# Altium schematic sheet S7CAS-PLEIADES-CARTE-MERE_P01_MOTORS.SchDoc
size Tabloid; DocumentNumber: 9; SheetNumber: 9; SheetTotal: 17; Sheet_Name: MOTORS; Size: 11x17
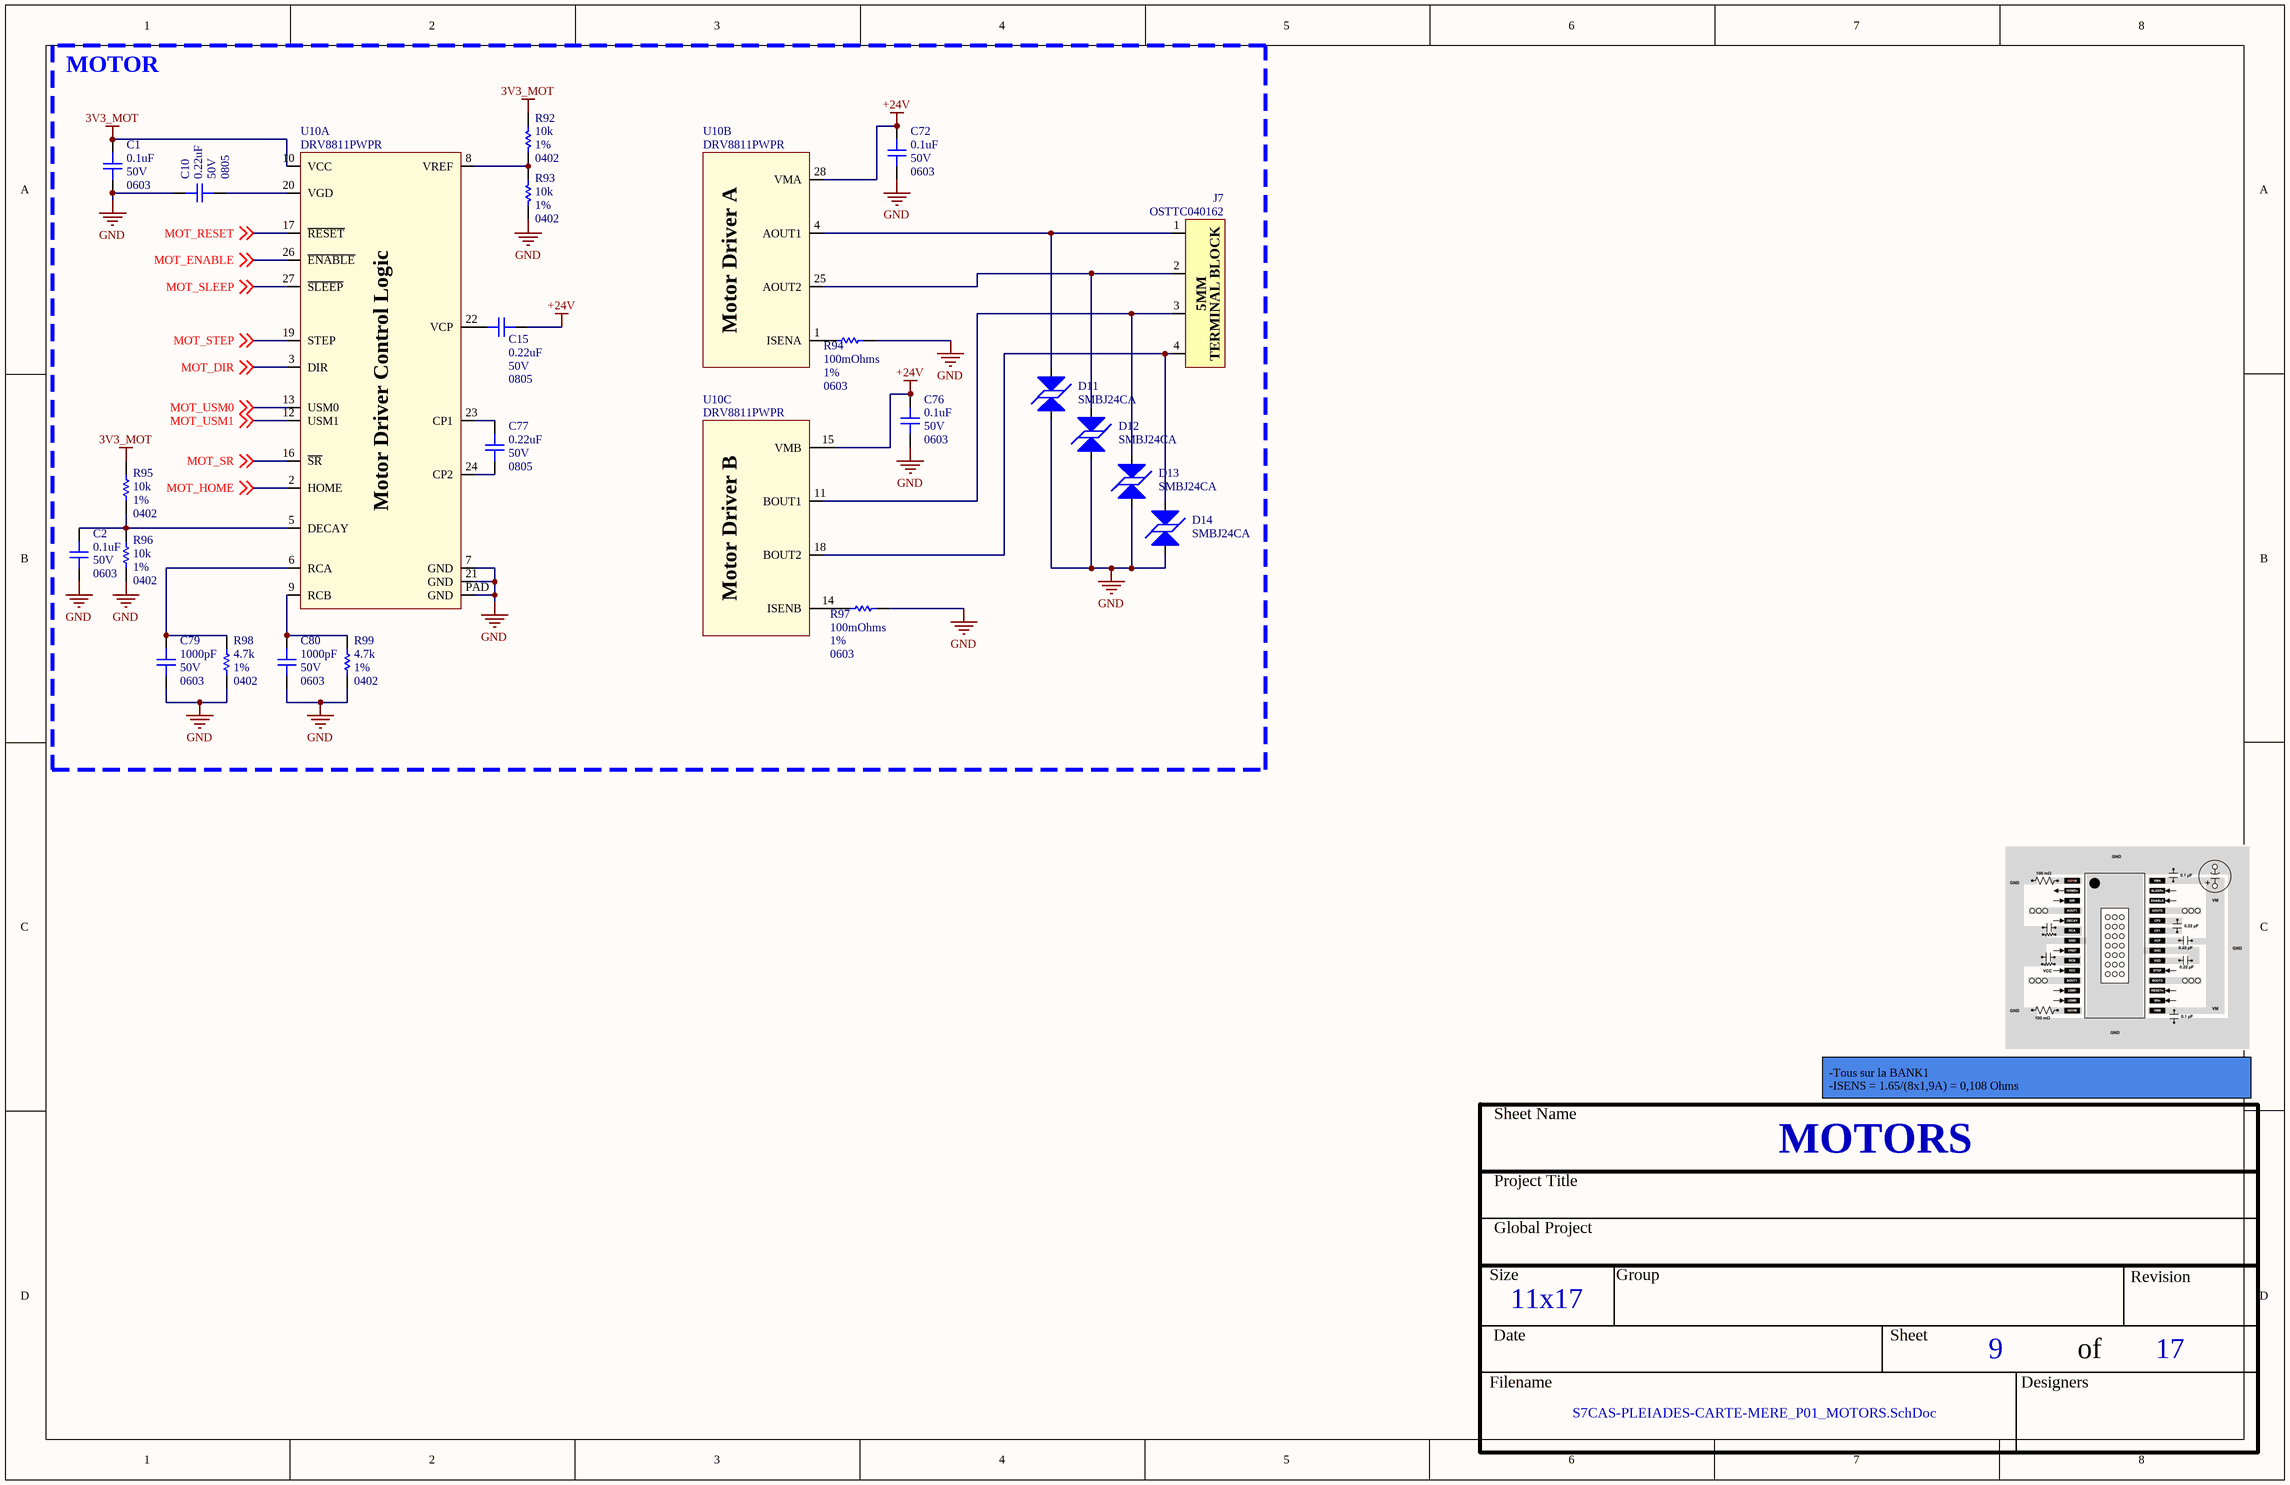
[diagram p0: S7CAS-PLEIADES-CARTE-MERE_P01_MOTORS.SchDoc]

## Parts
C1  value 0.1uF  Voltage: 50V  Package: 0603  [CAP_0603]  (hidden comment: CAP - 0603)
C2  value 0.1uF  Voltage: 50V  Package: 0603  [CAP_0603]  (hidden comment: CAP - 0603)
C10  value 0.22uF  Voltage: 50V  Package: 0805  [CAP_0805]  (hidden comment: CAP - 0805)
C15  value 0.22uF  Voltage: 50V  Package: 0805  [CAP_0805]  (hidden comment: CAP - 0805)
C72  value 0.1uF  Voltage: 50V  Package: 0603  [CAP_0603]  (hidden comment: CAP - 0603)
C76  value 0.1uF  Voltage: 50V  Package: 0603  [CAP_0603]  (hidden comment: CAP - 0603)
C77  value 0.22uF  Voltage: 50V  Package: 0805  [CAP_0805]  (hidden comment: CAP - 0805)
C79  value 1000pF  Voltage: 50V  Package: 0603  [CAP_0603]  (hidden comment: CAP - 0603)
C80  value 1000pF  Voltage: 50V  Package: 0603  [CAP_0603]  (hidden comment: CAP - 0603)
D11  SMBJ24CA  [TVS_PWR_SMBJ36CA]
D12  SMBJ24CA  [TVS_PWR_SMBJ36CA]
D13  SMBJ24CA  [TVS_PWR_SMBJ36CA]
D14  SMBJ24CA  [TVS_PWR_SMBJ36CA]
J7  OSTTC040162  [CONN_TERMINAL_OSTTA040161]
R92  value 10k  Package: 0402  Precision: 1%  [RES_0402]  (hidden comment: RES - 0402)
R93  value 10k  Package: 0402  Precision: 1%  [RES_0402]  (hidden comment: RES - 0402)
R94  value 100mOhms  Package: 0603  Precision: 1%  [RES_0603]  (hidden comment: RES - 0603)
R95  value 10k  Package: 0402  Precision: 1%  [RES_0402]  (hidden comment: RES - 0402)
R96  value 10k  Package: 0402  Precision: 1%  [RES_0402]  (hidden comment: RES - 0402)
R97  value 100mOhms  Package: 0603  Precision: 1%  [RES_0603]  (hidden comment: RES - 0603)
R98  value 4.7k  Package: 0402  Precision: 1%  [RES_0402]  (hidden comment: RES - 0402)
R99  value 4.7k  Package: 0402  Precision: 1%  [RES_0402]  (hidden comment: RES - 0402)
U10  DRV8811PWPR  [POW_MOTOR_DRV8811PWPR]  (parts A,B,C of 3)

## Blocks framed on the sheet
MOTOR: C1 C2 C10 C15 C72 C76 C77 C79 C80 D11-D14 J7 R92-R99 U10

## Nets
3V3_MOT: C1.2 R92.2 R95.2 U10.10(VCC)
+24V: C15.1 C72.2 C76.2 U10.15(VMB) U10.28(VMA)
GND: C1.1 C2.1 C10.2 C72.1 C76.1 C79.1 C80.1 D11.2 D12.2 D13.2 D14.2 R93.1 R94.1 R96.1 R97.1 R98.1 R99.1 U10.7(GND) U10.21(GND) U10.PAD(GND)
MOT_DIR: U10.3(DIR) ; off-sheet MOT_DIR
MOT_ENABLE: U10.26(~{ENABLE}) ; off-sheet MOT_ENABLE
MOT_HOME: U10.2(HOME) ; off-sheet MOT_HOME
MOT_RESET: U10.17(~{RESET}) ; off-sheet MOT_RESET
MOT_SLEEP: U10.27(~{SLEEP}) ; off-sheet MOT_SLEEP
MOT_SR: U10.16(~{SR}) ; off-sheet MOT_SR
MOT_STEP: U10.19(STEP) ; off-sheet MOT_STEP
MOT_USM0: U10.13(USM0) ; off-sheet MOT_USM0
MOT_USM1: U10.12(USM1) ; off-sheet MOT_USM1
NetC2_2: C2.2 R95.1 R96.2 U10.5(DECAY)
NetC10_1: C10.1 U10.20(VGD)
NetC15_2: C15.2 U10.22(VCP)
NetC77_1: C77.1 U10.24(CP2)
NetC77_2: C77.2 U10.23(CP1)
NetC79_2: C79.2 R98.2 U10.6(RCA)
NetC80_2: C80.2 R99.2 U10.9(RCB)
NetD11_1: D11.1 J7.1 U10.4(AOUT1)
NetD12_1: D12.1 J7.2 U10.25(AOUT2)
NetD13_1: D13.1 J7.3 U10.11(BOUT1)
NetD14_1: D14.1 J7.4 U10.18(BOUT2)
NetR92_1: R92.1 R93.2 U10.8(VREF)
NetR94_2: R94.2 U10.1(ISENA)
NetR97_2: R97.2 U10.14(ISENB)

## Notes on the sheet
- -Tous sur la BANK1
  -ISENS = 1.65/(8x1,9A) = 0,108 Ohms
- Sheet Name
- Project Title
- Global Project
- Size
- Group
- Revision
- Date
- Sheet
- of
- Filename
- Designers
- (in symbol CONN_TERMINAL_OSTTC040162) 5MM; TERMINAL BLOCK
- (in symbol POW_MOTOR_DRV8811PWPR, part A) Motor Driver Control Logic
- (in symbol POW_MOTOR_DRV8811PWPR, part B) Motor Driver A
- (in symbol POW_MOTOR_DRV8811PWPR, part C) Motor Driver B

## Library data of the parts
C1 C2 C72 C76 = CAP - 0603: 0.1 µF ±10% 50V Ceramic Capacitor X7R 0603 (1608 Metric); Mfg Part Number: C0603C104K5RACTU; Mfg: KEMET; Current: *; CreatedBy: Jonathan Bouchard; Power: *; Precision: 10%
C10 C15 C77 = CAP - 0805: 0.22 µF ±10% 50V Ceramic Capacitor X7R 0805 (2012 Metric); Mfg Part Number: C0805C224K5RACTU; Current: *; CreatedBy: Jonathan Bouchard; Power: *; Precision: 10%
C79 C80 = CAP - 0603: 1000 pF ±10% 50V Ceramic Capacitor X7R 0603 (1608 Metric); Mfg Part Number: C0603C102K5RACTU; Mfg: KEMET; Current: *; CreatedBy: Jonathan Bouchard; Power: *; Precision: 10%
D11-D14 = TVS_PWR_SMBJ24CA: TVS - 24V 26.7V 600W - DO214AA; Manufacturer #1: Littelfuse Inc.; Value: Vbr = 26.7V -  Clamp = 38.9V; Voltage Rating: 24V Standoff; Current Rating: 15.5A; GRAMS Lib Spec: 2.8; Magnetic Material: UNKNOWN; Polarized: NO; Tolerance: *; Power Max: 600W; HelpURL: http://www.littelfuse.com/~/media/electronics/datasheets/tvs_diodes/littelfuse_tvs_diode_smbj_datasheet.pdf.pdf; CreatedBy/Date: Arnaud Samson - 06/07/18; VerifiedBy: Jonathan Bouchard - 2018-07-13; Temperature: -65°C ~ 150°C (TJ); Package: DO214AA; Manufacturer #2: *; Note: *; Assembly Type: SMD; Part Number #2: *; Part Number #1: SMBJ24CA; Supplier 1: Digi-Key; Supplier Part Number 1: SMBJ24CALFCT-ND; Cryo: UNKNOWN
J7 = CONN_TERMINAL_OSTTC040162: CONN -  TERMINAL BLOCK 4POS 5MM - TH; Mfg: On Shore Technology Inc.; Voltage: *; Current: *; Power: *; Mfg Part Number: OSTTC040162; HelpURL: http://www.on-shore.com/wp-content/uploads/2015/09/osttcxx0162.pdf; CreatedBy: Jonathan Bouchard; Temperature: -30°C ~ 105°C; Value: *; Precision: *; Package: TH-4; Supplier 1: Digikey; Supplier Part Number 1: ED2602-ND
R92 R93 R95 R96 = RES - 0402: 10 kOhms ±1% 0.063W, 1/16W Chip Resistor 0402 (1005 Metric) Automotive AEC-Q200 Thick Film; Mfg Part Number: RMCF0402FT10K0; Voltage: 75V; Current: *; CreatedBy: Jonathan Bouchard; Power: 1/16W; Part Number #1: RMCF0402FT10K0
R94 R97 = RES - 0603: 100 mOhms ±1% 0.333W, 1/3W Chip Resistor 0603 (1608 Metric) Automotive AEC-Q200, Current Sense Thick Film; Mfg Part Number: ERJ-3BWFR100V; Mfg: Panasonic Electronic Components; Current: *; CreatedBy: Jonathan Bouchard
R98 R99 = RES - 0402: 4.7 kOhms ±1% 0.063W, 1/16W Chip Resistor 0402 (1005 Metric) Moisture Resistant Thick Film; Mfg Part Number: RC0402FR-074K7L; Voltage: 75V; Current: *; CreatedBy: Jonathan Bouchard; Power: 1/16W; Part Number #1: RC0402FR-074K7L
U10 = POW_MOTOR_DRV8811PWPR: POW - STEPPER MOTOR DRIVER - SOP-28; Voltage: 3 V ~ 5.5 V / 8 V ~ 38 V; Mfg: Texas Instrument; Current: *; Power: *; Mfg Part Number: DRV8811PWPR; HelpURL: http://www.ti.com/lit/ds/symlink/drv8811.pdf; CreatedBy: Jonathan Bouchard; Temperature: -40°C ~ 150°C (TJ); Value: *; Precision: *; Package: SOP-28; Supplier 1: Digikey; Supplier Part Number 1: 296-24591-1-ND